# EasyEDA schematic OCC test.json
TITLE: Sheet_1; REV: 1.0; Date: 2024-12-10; Sheet: 1/1; Drawn By: helmut-f; Company: Your Company
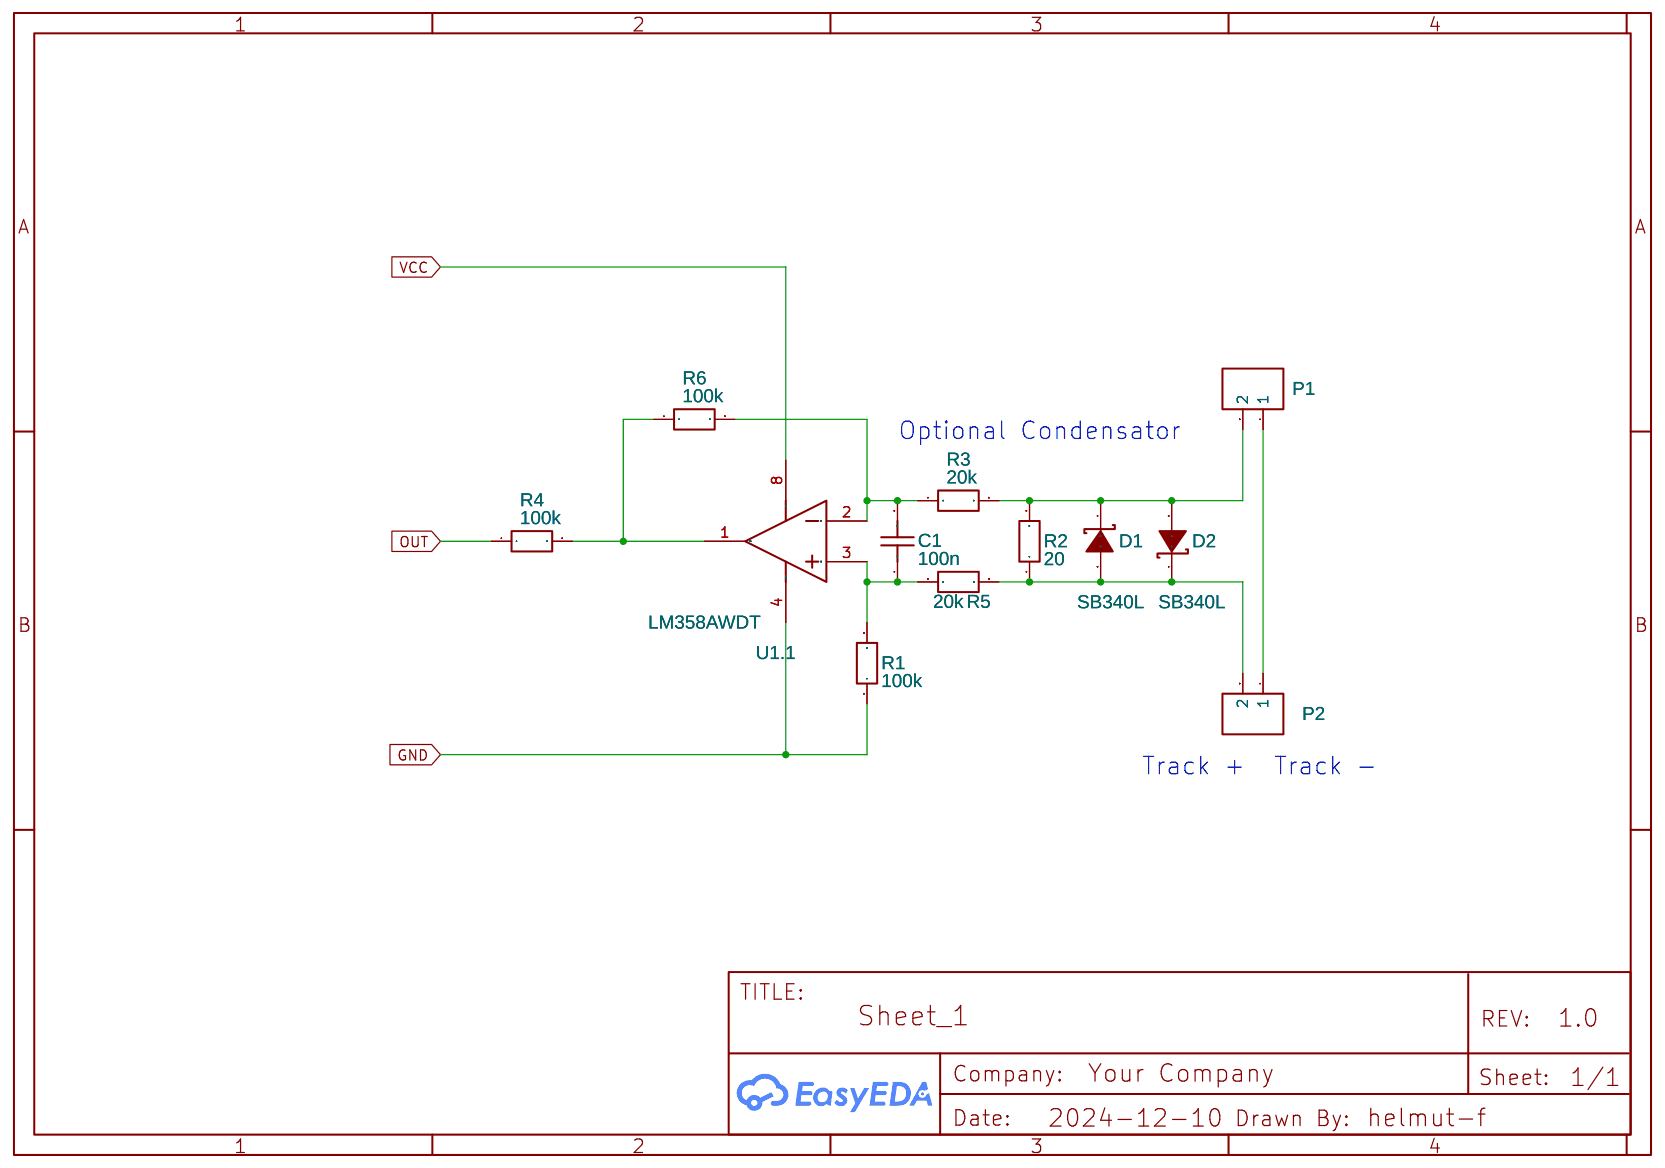
[diagram p0: schematic sheet]

## Parts
C1  100n  [RAD-0.1]
D1  SB340L  [DO-27_BD5.2-L8.9-P12.90-D1.5-RD]
D2  SB340L  [DO-27_BD5.2-L8.9-P12.90-D1.5-RD]
P1  CONN-TH_2P-P5.08  [CONN-TH_2P-P5.08]
P2  CONN-TH_2P-P5.08  [CONN-TH_2P-P5.08]
R1  100k  [R1206]
R2  20  [R1206]
R3  20k  [R1206]
R4  100k  [R1206]
R5  20k  [R1206]
R6  100k  [R1206]
U1  LM358AWDT  [SO-8_L4.9-W3.9-P1.27-LS5.9-BL]  (section 1)

## Library data of the parts
C1 = C_RAD-0.1_US: Contributor: LCEDA_Lib
D1 D2 = SB340L: Contributor: LCSC; Supplier: LCSC; Supplier Part: C432802; Manufacturer: PINGWEI(平伟); JLCPCB Part Class: Extended Part
P1 P2 = CONN-TH_2P-P5.08: Supplier: LCSC; Contributor: LCEDA_Lib
R1-R6 = R_1206_EU: Contributor: LCEDA_Lib
U1 = LM358AWDT: subpart_no: 1; Supplier: LCSC; Supplier Part: C2969987; Manufacturer: ST(意法半导体); JLCPCB Part Class: Extended Part

## Nets
GND: R1.1 U1.4(VCC-)
VCC: U1.8(VCC+)
OUT: R4.1
Net-(C1-1): C1.1 R1.2 R5.1 U1.3(IN1+)
Net-(C1-2): C1.2 R3.1 R6.2 U1.2(IN1-)
Net-(D1-1): D1.1(K) D2.2(A) P1.2 R2.2 R3.2
Net-(D1-2): D1.2(A) D2.1(K) P2.2 R2.1 R5.2
Net-(P1-1): P1.1 P2.1
Net-(R4-2): R4.2 R6.1 U1.1(OUT1)

## Notes on the sheet
- Optional Condensator
- Track +
- Track -
